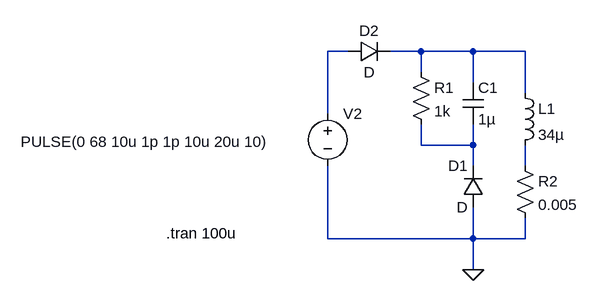
[diagram p0: schematic RCD_protection.asc]
RCD_protection.asc, the LTspice schematic file:
Version 4
SHEET 1 880 680
WIRE -112 -272 -144 -272
WIRE 0 -272 -48 -272
WIRE 80 -272 0 -272
WIRE 160 -272 80 -272
WIRE 0 -240 0 -272
WIRE 80 -224 80 -272
WIRE 160 -208 160 -272
WIRE -144 -176 -144 -272
WIRE 0 -128 0 -160
WIRE 80 -128 80 -160
WIRE 80 -128 0 -128
WIRE 80 -96 80 -128
WIRE 160 -96 160 -128
WIRE -144 16 -144 -96
WIRE 80 16 80 -32
WIRE 80 16 -144 16
WIRE 160 16 160 -16
WIRE 160 16 80 16
WIRE 80 64 80 16
FLAG 80 64 0
SYMBOL ind 144 -224 R0
SYMATTR InstName L1
SYMATTR Value 34µ
SYMATTR SpiceLine Rser=0.01
SYMBOL cap 64 -224 R0
SYMATTR InstName C1
SYMATTR Value 1µ
SYMBOL res -16 -256 R0
SYMATTR InstName R1
SYMATTR Value 1k
SYMBOL diode 96 -32 R180
WINDOW 0 24 64 Left 2
WINDOW 3 24 0 Left 2
SYMATTR InstName D1
SYMBOL res 144 -112 R0
SYMATTR InstName R2
SYMATTR Value 0.005
SYMBOL voltage -144 -192 R0
WINDOW 3 -472 59 Left 2
WINDOW 123 0 0 Left 0
WINDOW 39 0 0 Left 0
SYMATTR Value PULSE(0 68 10u 1p 1p 10u 20u 10)
SYMATTR InstName V2
SYMBOL diode -112 -256 R270
WINDOW 0 32 32 VTop 2
WINDOW 3 0 32 VBottom 2
SYMATTR InstName D2
TEXT -392 8 Left 2 !.tran 100u

The netlist it stands for:
* RCD_protection.asc
L1 N002 N004 34µ Rser=0.01
C1 N002 N003 1µ
R1 N002 N003 1k
D1 0 N003 D
R2 N004 0 0.005
V2 N001 0 PULSE(0 68 10u 1p 1p 10u 20u 10)
D2 N001 N002 D
.model D D
.lib standard.dio
.tran 100u
.backanno
.end